# Altium schematic sheet Power_Supply_And_Connections.SchDoc
size A
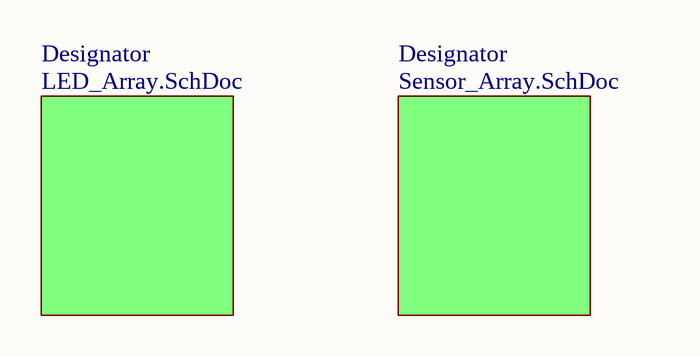
[diagram p0: Power_Supply_And_Connections.SchDoc]

## Sub-sheets
Designator = LED_Array.SchDoc: no entries
Designator = Sensor_Array.SchDoc: no entries